# Altium schematic sheet Sheet_1_2023-09-05.schdoc
size 302 x 206 mm
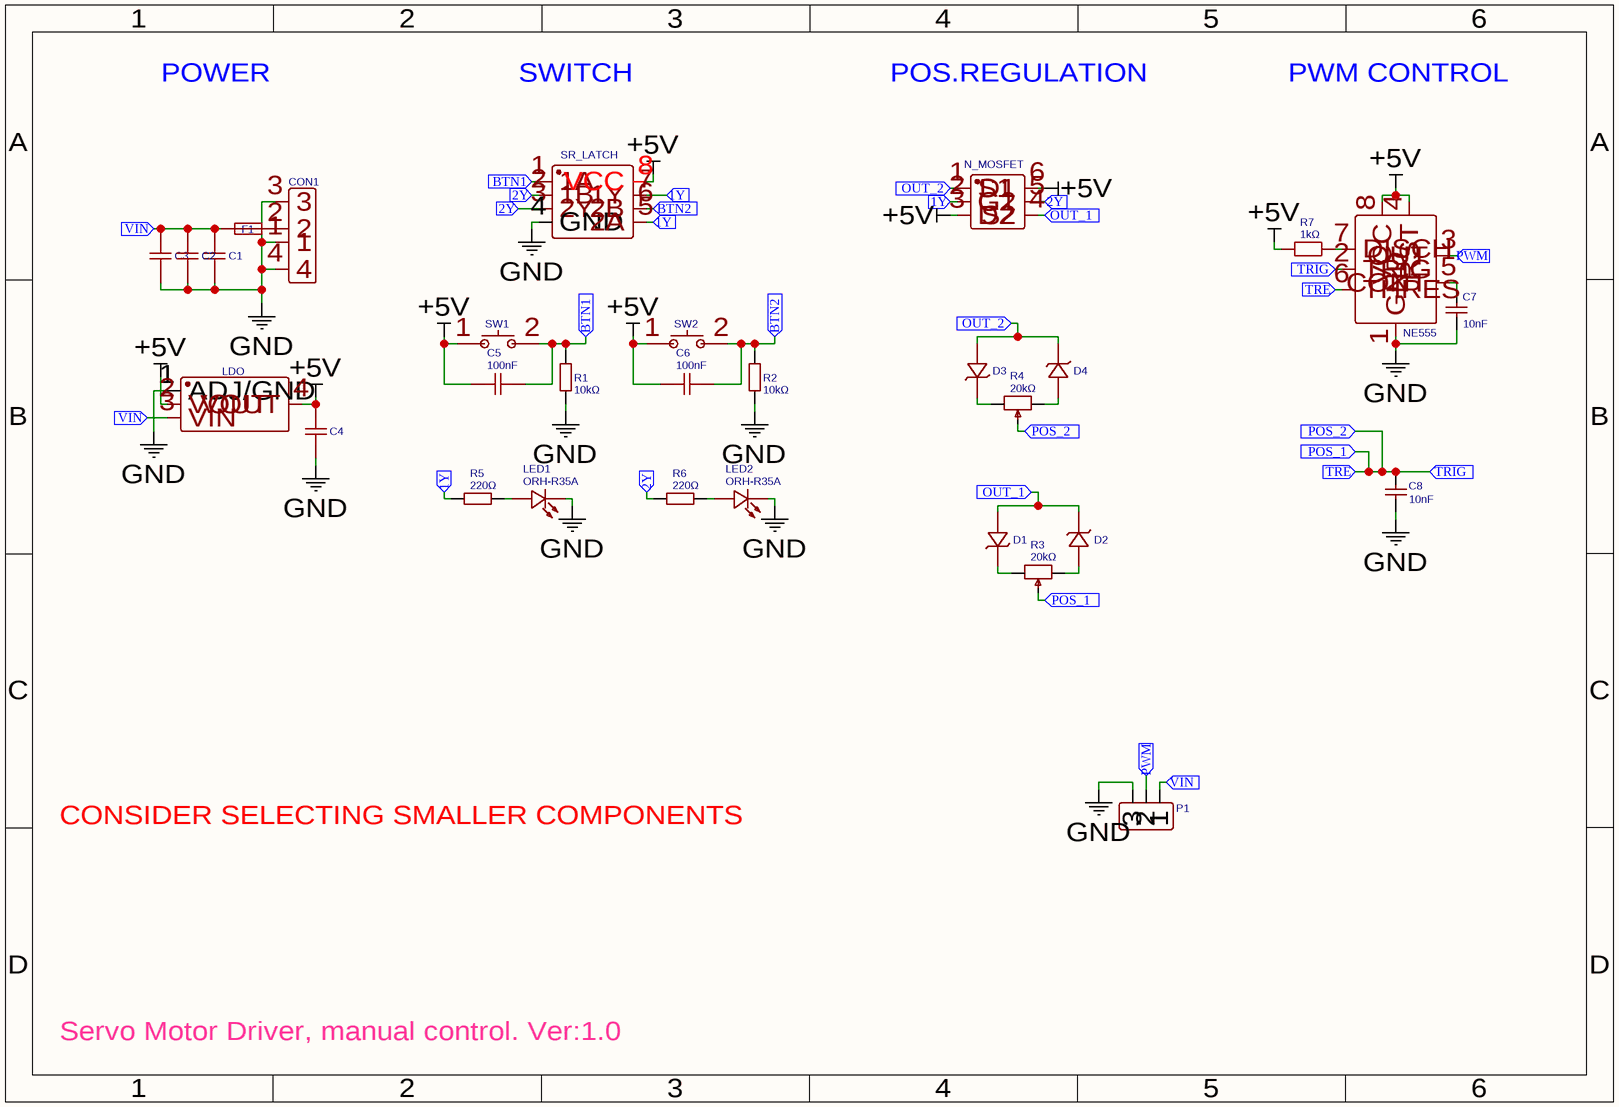
[diagram p0: Sheet_1_2023-09-05.schdoc]

## Parts
C1  100uF  [C1206]  (value not drawn)
C2  100uF  [C1206]  (value not drawn)
C3  100uF  [C1206]  (value not drawn)
C4  100uF  [C1206]  (value not drawn)
C5  100nF  [C0603]
C6  100nF  [C0603]
C7  10nF  [C1206]
C8  10nF  [C1206]
CON1  SM02B-SRSS-TB (LF)(SN)  [CONN-SMD_2P-P1.00_SM02B-SRSS-TB-LF-SN]  (value not drawn)
D1  1N4007_C727082  [SOD-123FL_L2.7-W1.8-LS3.8-RD]  (value not drawn)
D2  1N4007_C727082  [SOD-123FL_L2.7-W1.8-LS3.8-RD]  (value not drawn)
D3  1N4007_C727082  [SOD-123FL_L2.7-W1.8-LS3.8-RD]  (value not drawn)
D4  1N4007_C727082  [SOD-123FL_L2.7-W1.8-LS3.8-RD]  (value not drawn)
F1  MF-MSMF110/16-2  [F1812]  (value not drawn)
LDO  AMS1117-5.0_C473812  [SOT-223-3_L6.7-W3.7-P2.30-LS7.0-BR]  (value not drawn)
LED1  ORH-R35A  [LED0805-R-RD]
LED2  ORH-R35A  [LED0805-R-RD]
N_MOSFET  2N7002DWH6327XTSA1  [SOT-363_L2.0-W1.3-P0.65-LS2.1-BR]  (value not drawn)
NE555  100kHz  [SOIC-8_L4.9-W3.9-P1.27-LS6.0-BL]  (value not drawn)
P1  Header-Female-2.54_1x3  [HDR-TH_3P-P2.54-V-F]  (value not drawn)
R1  10kΩ  [R0603]
R2  10kΩ  [R0603]
R3  20kΩ  [RES-ADJ-SMD_3P-L3.8-W3.0-P2.00-BL-FS]
R4  20kΩ  [RES-ADJ-SMD_3P-L3.8-W3.0-P2.00-BL-FS]
R5  220Ω  [R0603]
R6  220Ω  [R0603]
R7  1kΩ  [R1206]
SR_LATCH  SN74LVC2G02DCUR  [VSSOP-8_L2.3-W2.0-P0.50-LS3.1-BR]  (value not drawn)
SW1  GT-TC029B-H025-L1N  [SW-SMD_L3.9-W3.0-P4.45]  (value not drawn)
SW2  GT-TC029B-H025-L1N  [SW-SMD_L3.9-W3.0-P4.45]  (value not drawn)

## Ports
1Y (in), 2Y (in), BTN1 (in), BTN2 (in), OUT_1 (in), OUT_2 (in), POS_1 (in), POS_2 (in), PWM (in), TRE (in), TRIG (in), VIN (in)

## Nets
+5V: C4.2 C5.2 C6.2 LDO.2(VOUT) LDO.4(VOUT) N_MOSFET.3(D2) N_MOSFET.6(D1) NE555.4(RST) NE555.8(VCC) R7.1 SR_LATCH.8(VCC) SW1.1 SW2.1
GND: C1.1 C2.1 C3.1 C4.1 C7.1 C8.1 CON1.1 CON1.3 CON1.4 LDO.1(ADJ/GND) LED1.2(C) LED2.2(C) NE555.1(GND) P1.3 R1.1 R2.1 SR_LATCH.4(GND)
1Y: N_MOSFET.2(G1) R5.1 SR_LATCH.5(2A) SR_LATCH.7(1Y) ; port 1Y
2Y: N_MOSFET.5(G2) R6.1 SR_LATCH.2(1B) SR_LATCH.3(2Y) ; port 2Y
BTN1: C5.1 R1.2 SR_LATCH.1(1A) SW1.2 ; port BTN1
BTN2: C6.1 R2.2 SR_LATCH.6(2B) SW2.2 ; port BTN2
OUT_1: D1.2(A) D2.1(K) N_MOSFET.4(S2) ; port OUT_1
OUT_2: D3.2(A) D4.1(K) N_MOSFET.1(S1) ; port OUT_2
POS_1: C8.2 NE555.2(TRIG) NE555.6(THRES) R3.2 R4.2 ; port POS_1, port POS_2, port TRE, port TRIG
PWM: NE555.3(OUT) P1.2 ; port PWM
VIN: C1.2 C2.2 C3.2 F1.1 LDO.3(VIN) P1.1 ; port VIN
NetC7_2: C7.2 NE555.5(CONT)
NetCON1_2: CON1.2 F1.2
NetD1_1: D1.1(K) R3.3
NetD2_2: D2.2(A) R3.1
NetD3_1: D3.1(K) R4.3
NetD4_2: D4.2(A) R4.1
NetLED1_1: LED1.1(A) R5.2
NetLED2_1: LED2.1(A) R6.2
NetNE555_7: NE555.7(DISCH) R7.2

## Notes on the sheet
- POWER
- SWITCH
- POS.REGULATION
- PWM CONTROL
- CONSIDER SELECTING SMALLER COMPONENTS
- Servo Motor Driver, manual control. Ver:1.0

## Library data of the parts
C1-C4 = 100uF: Manufacturer: muRata(村田); Manufacturer Part: GRM31CR61A107MEA8L; nameAlias: Value; Contributor: lcsc; Supplier: LCSC; Supplier Part: C883598; JLCPCB Part Class: Extended Part; link: https://lcsc.com/eda_search?q=C883598&%26type=1&ref=editor; spicePre: C; spiceSymbolName: GRM31CR61A107MEA8L
C5 C6 = 100nF: Manufacturer: SAMSUNG(三星); Manufacturer Part: CL10B104KB8NNNC; nameAlias: Value; Supplier: LCSC; Supplier Part: C1591; JLCPCB Part Class: Extended Part; link: https://lcsc.com/eda_search?q=C1591&%26type=1&ref=editor; spicePre: C; spiceSymbolName: CL10B104KB8NNNC
C7 C8 = 10nF: Manufacturer: FH(风华); Manufacturer Part: 1206B103K102NT; nameAlias: Value; Supplier: LCSC; Supplier Part: C9194; JLCPCB Part Class: Extended Part; link: https://lcsc.com/eda_search?q=C9194&%26type=1&ref=editor; spicePre: C; spiceSymbolName: 1206B103K102NT
CON1 = SM02B-SRSS-TB (LF)(SN): Manufacturer: JST; Contributor: LCSC; Supplier: LCSC; Supplier Part: C160402; Manufacturer Part: SM02B-SRSS-TB(LF)(SN); JLCPCB Part Class: Extended Part; link: https://lcsc.com/eda_search?q=C160402&%26type=1&ref=editor; spicePre: C; spiceSymbolName: SM02B-SRSS-TB (LF)(SN)
D1-D4 = 1N4007_C727082: Manufacturer: TWGMC(台湾迪嘉); Manufacturer Part: 1N4007; Contributor: LCSC; JLCPCB Part Class: Extended Part; Supplier: LCSC; Supplier Part: C727082; link: https://lcsc.com/eda_search?q=C727082&%26type=1&ref=editor; spicePre: D; spiceSymbolName: 1N4007_C727082
F1 = MF-MSMF110/16-2: Manufacturer: BOURNS; Contributor: LCSC; Supplier: LCSC; Supplier Part: C210834; Manufacturer Part: MF-MSMF110/16-2; JLCPCB Part Class: Extended Part; link: https://lcsc.com/eda_search?q=C210834&%26type=1&ref=editor; spicePre: F; spiceSymbolName: MF-MSMF110/16-2
LDO = AMS1117-5.0_C473812: Manufacturer: Slkor(萨科微); Contributor: LCSC; Supplier: LCSC; Supplier Part: C473812; Manufacturer Part: AMS1117-5.0; JLCPCB Part Class: Extended Part; link: https://lcsc.com/eda_search?q=C473812&%26type=1&ref=editor; spicePre: U; spiceSymbolName: AMS1117-5.0_C473812
LED1 LED2 = ORH-R35A: Manufacturer: Orient(奥伦德); Contributor: LCSC; Supplier: LCSC; Supplier Part: C205444; Manufacturer Part: ORH-R35A; JLCPCB Part Class: Extended Part; link: https://lcsc.com/eda_search?q=C205444&%26type=1&ref=editor; spicePre: L; spiceSymbolName: ORH-R35A
N_MOSFET = 2N7002DWH6327XTSA1: Manufacturer: Infineon(英飞凌); Contributor: LCSC; Supplier: LCSC; Manufacturer Part: 2N7002DWH6327; Supplier Part: C151535; JLCPCB Part Class: Extended Part; link: https://lcsc.com/eda_search?q=C151535&%26type=1&ref=editor; spicePre: Q; spiceSymbolName: 2N7002DWH6327XTSA1
NE555 = 100kHz: Manufacturer: TI(德州仪器); Manufacturer Part: NE555DR; nameAlias: Value; spicePre: X; Supplier: LCSC; Supplier Part: C7593; JLCPCB Part Class: Basic Part; link: https://lcsc.com/eda_search?q=C7593&%26type=1&ref=editor; spiceSymbolName: NE555DR
P1 = Header-Female-2.54_1x3: Manufacturer: BOOMELE(博穆精密); Manufacturer Part: 2.54-1*3P母; Supplier Part: C146243; Supplier: LCSC; JLCPCB Part Class: Extended Part; link: https://lcsc.com/eda_search?q=C146243&%26type=1&ref=editor; spicePre: P; spiceSymbolName: Header-Female-2.54_1x3
R1 R2 = 10kΩ: Manufacturer: UNI-ROYAL(厚声); Manufacturer Part: 0603WAF1002T5E; nameAlias: Value; Supplier: LCSC; Supplier Part: C25804; JLCPCB Part Class: Basic Part; link: https://lcsc.com/eda_search?q=C25804&%26type=1&ref=editor; spicePre: R; spiceSymbolName: 0603WAF1002T5E
R3 R4 = 20kΩ: Manufacturer: HDK(北陆电气); Manufacturer Part: VG039NCHXTB203; nameAlias: Value; Resistance(Ohms): 20K; Supplier: LCSC; Supplier Part: C128550; JLCPCB Part Class: Extended Part; link: https://lcsc.com/eda_search?q=C128550&%26type=1&ref=editor; spicePre: R; spiceSymbolName: VG039NCHXTB203
R5 R6 = 220Ω: Manufacturer: YAGEO(国巨); Manufacturer Part: RC0603FR-07220RL; nameAlias: Value; Supplier: LCSC; Supplier Part: C107696; JLCPCB Part Class: Extended Part; link: https://lcsc.com/eda_search?q=C107696&%26type=1&ref=editor; spicePre: R; spiceSymbolName: RC0603FR-07220RL
R7 = 1kΩ: Manufacturer: Viking(光颉); Manufacturer Part: CR-06JA7----1K; nameAlias: Value; Contributor: LCSC; Supplier: LCSC; Supplier Part: C408770; JLCPCB Part Class: Extended Part; link: https://lcsc.com/eda_search?q=C408770&%26type=1&ref=editor; spicePre: R; spiceSymbolName: CR-06JA7----1K
SR_LATCH = SN74LVC2G02DCUR: Manufacturer: TI(德州仪器); Supplier: LCSC; Manufacturer Part: SN74LVC2G02DCUR; Supplier Part: C133589; JLCPCB Part Class: Extended Part; link: https://lcsc.com/eda_search?q=C133589&%26type=1&ref=editor; spicePre: U; spiceSymbolName: SN74LVC2G02DCUR
SW1 SW2 = GT-TC029B-H025-L1N: Manufacturer: G-Switch(品赞); Contributor: LCSC; Supplier: LCSC; Supplier Part: C843669; Manufacturer Part: GT-TC029B-H025-L1N; JLCPCB Part Class: Extended Part; link: https://lcsc.com/eda_search?q=C843669&%26type=1&ref=editor; spicePre: S; spiceSymbolName: GT-TC029B-H025-L1N